# Altium schematic sheet Sheet1.SchDoc
size Letter
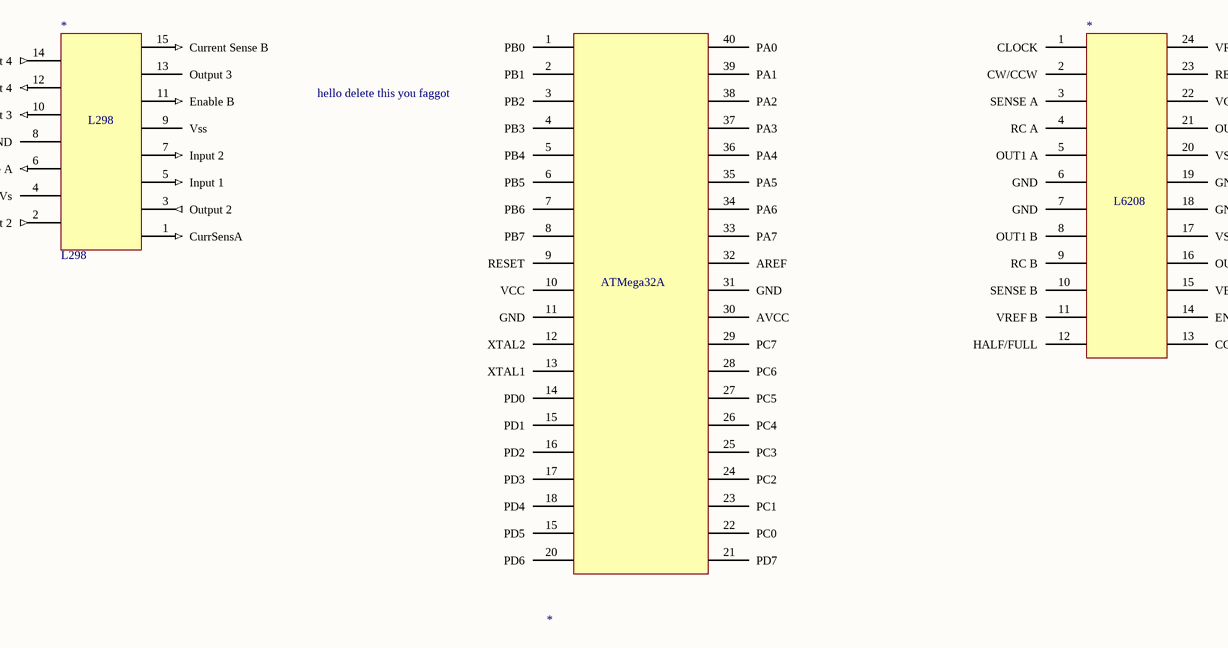
[diagram p0: Sheet1.SchDoc]

## Parts
(Parts that share a designator on the sheet are numbered #1, #2 ... from top to bottom, then left to right.)
*#1  L6208  (value not drawn)
*#2  L298
ATMega32A  *

## Nets

Not connected (* = marked no-connect by the designer): *#1 1(CLOCK) 2(CW/CCW) 3(SENSE_A) 4(RC_A) 5(OUT1_A) 6(GND) 7(GND) 8(OUT1_B) 9(RC_B) 10(SENSE_B) 11(VREF_B) 12(HALF/FULL) 13(CONTROL) 14(EN) 15(VBOOT) 16(OUT2_B) 17(VS_B) 18(GND) 19(GND) 20(VS_A) 21(OUT2_A) 22(VCP) 23(RESET) 24(VREF_A); *#2 1(CurrSensA) 2(Output_2) 3(Output_2) 4(Vs) 5(Input_1) 6(Enable_A) 7(Input_2) 8(GND) 9(Vss) 10(Input_3) 11(Enable_B) 12(Input_4) 13(Output_3) 14(Output_4) 15(Current_Sense_B); ATMega32A 1(PB0) 2(PB1) 3(PB2) 4(PB3) 5(PB4) 6(PB5) 7(PB6) 8(PB7) 9(RESET) 10(VCC) 11(GND) 12(XTAL2) 13(XTAL1) 14(PD0) 15(PD1) 16(PD2) 17(PD3) 18(PD4) 20(PD6) 21(PD7) 22(PC0) 23(PC1) 24(PC2) 25(PC3) 26(PC4) 27(PC5) 28(PC6) 29(PC7) 30(AVCC) 31(GND) 32(AREF) 33(PA7) 34(PA6) 35(PA5) 36(PA4) 37(PA3) 38(PA2) 39(PA1) 40(PA0)

## Notes on the sheet
- (near ATMega32A) hello delete this you faggot

## Library data of the parts
ATMega32A = ATMega32A